# EAGLE design Programmer_ISO (EAGLE 5.04)
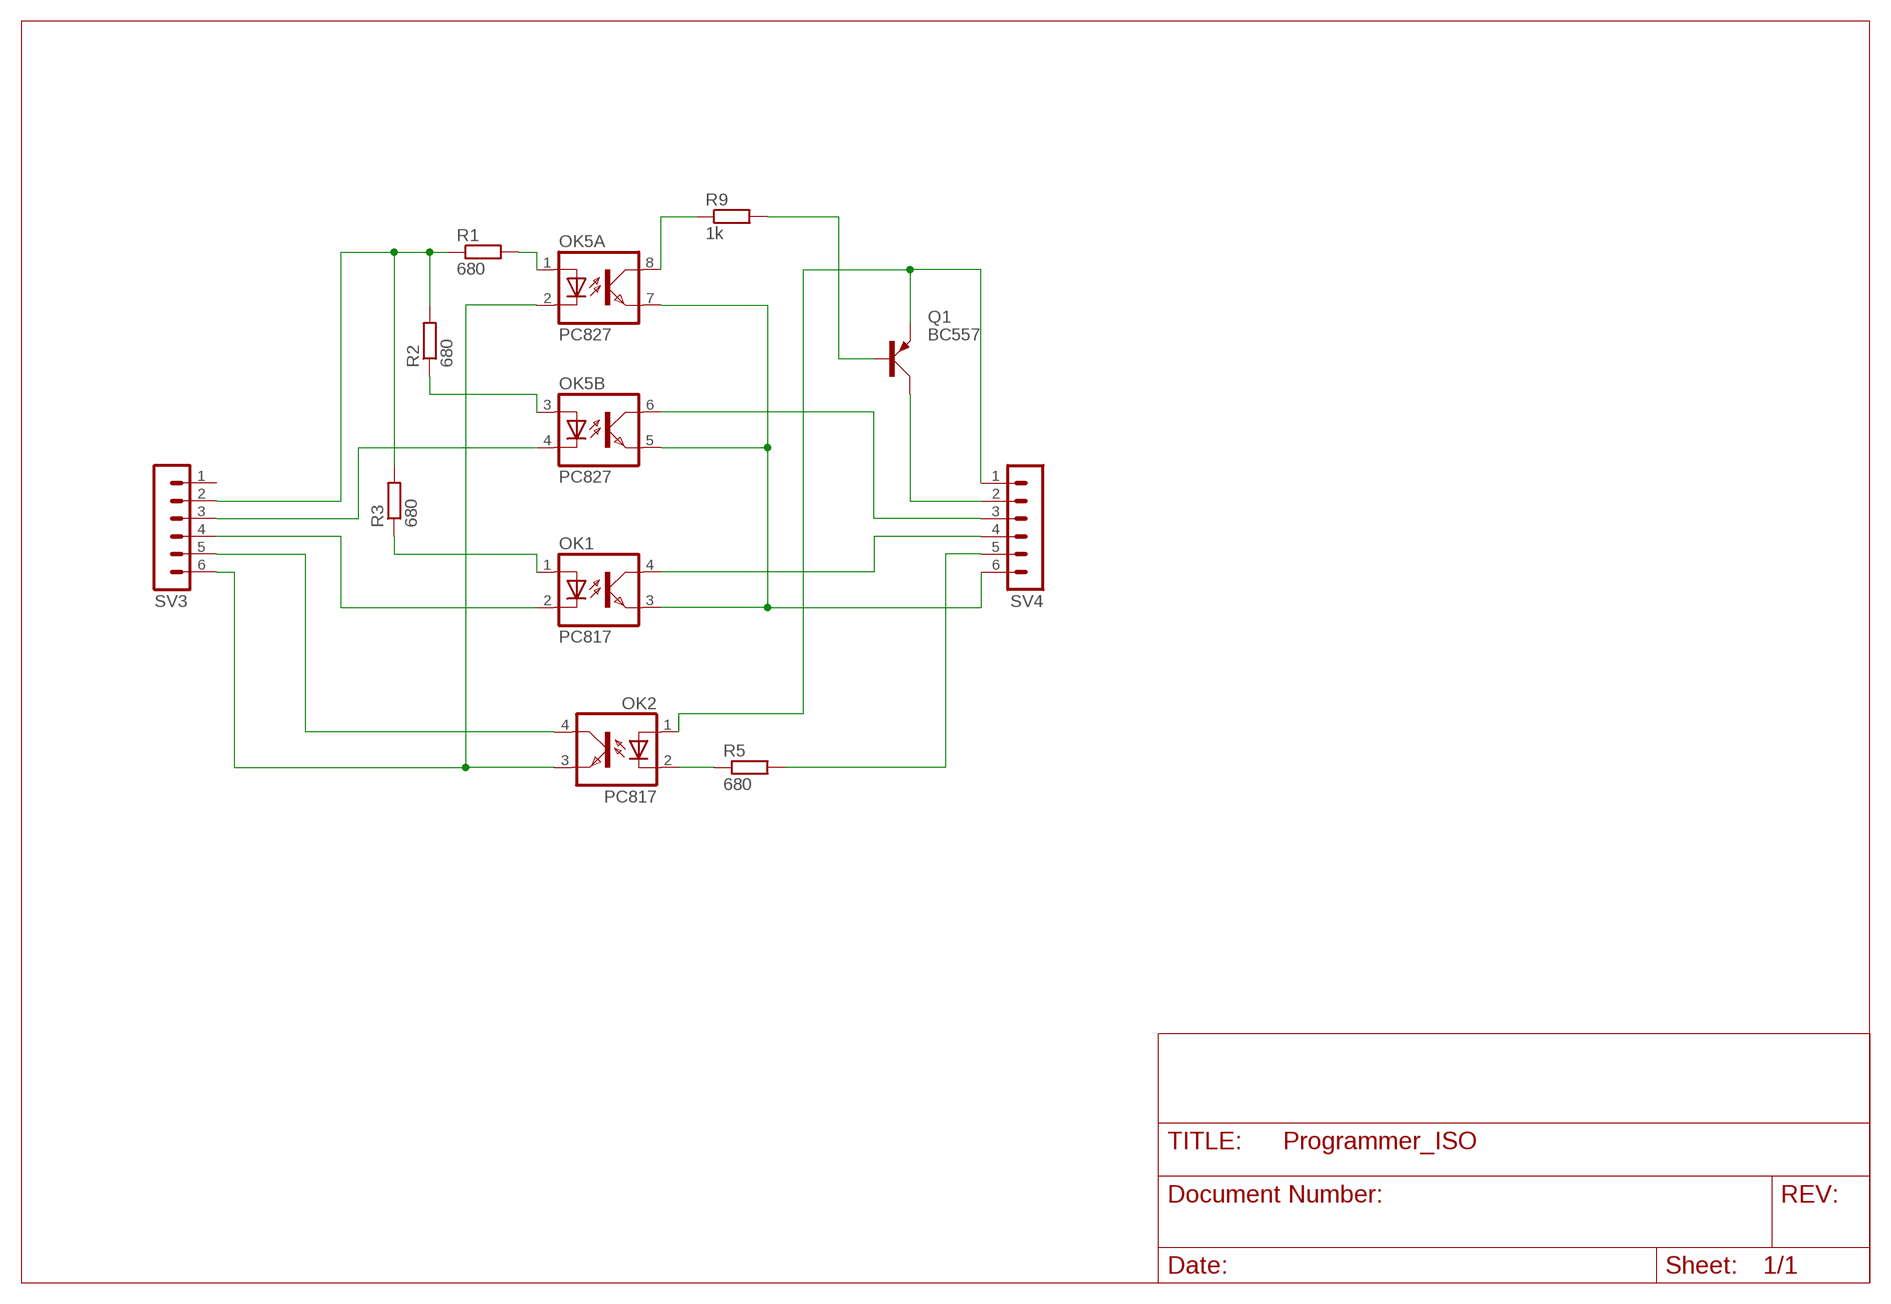
[diagram p0: schematic, sheet 1]

## Parts
OK1  PC817  [DIL04]
OK2  PC817  [DIL04]
OK5  PC827  [DIL08]
Q1  BC557  [SOT54A]
R1  680  R-EU_0207/7  [0207/7]
R2  680  R-EU_0207/7  [0207/7]
R3  680  R-EU_0207/7  [0207/7]
R5  680  R-EU_0207/7  [0207/7]
R9  1k  R-EU_0207/7  [0207/7]
SV3  MA06-1  [MA06-1]
SV4  MA06-1  [MA06-1]

## Nets
GND_PROG: OK2.3(EMIT) OK5.2(A:C) SV3.6
GND_TARGET: OK1.3(EMIT) OK5.5(B:EMIT) OK5.7(A:EMIT) SV4.6
N$1: OK5.8(A:COL) R9.1
N$2: Q1.B R9.2
N$3: OK1.1(A) R3.1
N$6: OK5.1(A:A) R1.2
N$7: OK5.3(B:A) R2.1
N$13: OK2.2(C) R5.1
RST_PROG: OK5.4(B:C) SV3.3
RST_TARGET: OK5.6(B:COL) SV4.3
RXD_PROG: OK2.4(COL) SV3.5
RXD_TARGET: R5.2 SV4.5
TXD_PROG: OK1.2(C) SV3.4
TXD_TARGET: OK1.4(COL) SV4.4
VCC_PROG: R1.1 R2.2 R3.2 SV3.2
VIN_TARGET: Q1.C SV4.2
VOUT_TARGET: OK2.1(A) Q1.E SV4.1
Unconnected: SV3.1

## Library data of the parts
OK1 OK2 = optocoupler:PC817: SHARP OPTO COUPLER
OK5 = optocoupler:PC827: SHARP OPTO COUPLER
Q1 = transistor-small-signal:BC557: PNP TRANSISTOR
R1-R3 R5 R9 = rcl:R-EU_: RESISTOR, European symbol
SV3 SV4 = con-lstb:MA06-1: PIN HEADER

## Board
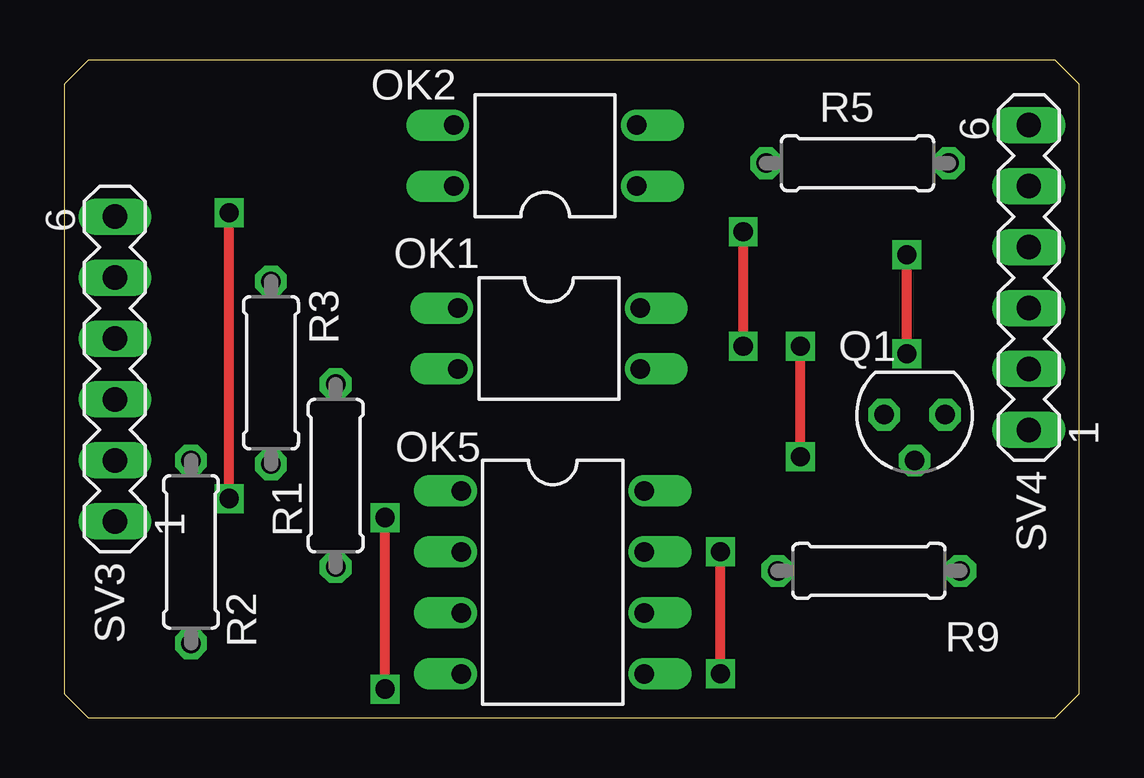
[diagram p1: board, top side]
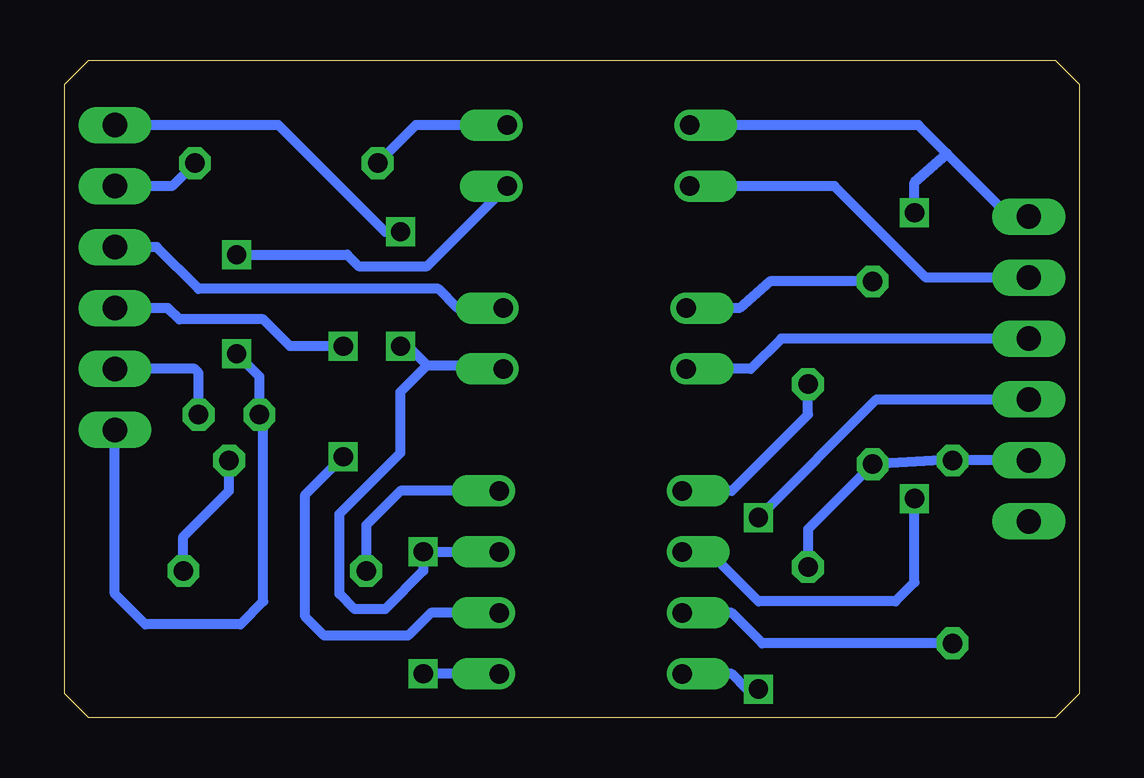
[diagram p2: board, bottom side, seen from below]

Size 42.3 x 27.4 mm. Coordinates in mm from the lower left corner, seen from the top.
Outline: 1,0 41.3,0 42.3,1 42.3,26.4 41.3,27.4 1,27.4 0,26.4 0,1 1,0
Copper layers (1*16): Top 0.035mm / dielectric 1.5mm / Bottom 0.035mm
Design rules "default": minimum track width 10mil, minimum drill 24mil, track to track 8mil, track to pad 8mil, pad to pad 8mil, via to via 8mil, smd to smd 8mil, copper to edge 40mil, drill to drill 8mil, minimum pad ring 10mil, minimum via ring 8mil, stop-mask expansion 4mil, vias tented up to drill 0mil, thermal gap 10mil

### Footprints (pad centres in the part's own frame; a part is rotated, then mirrored left to right if it is on the bottom)
DIL04 = drill 0.813 offset: 1 -1.27,-3.81; 2 1.27,-3.81; 3 1.27,3.81; 4 -1.27,3.81
DIL08 = drill 0.813 offset: 1 -3.81,-3.81; 2 -1.27,-3.81; 3 1.27,-3.81; 4 3.81,-3.81; 5 3.81,3.81; 6 1.27,3.81; 7 -1.27,3.81; 8 -3.81,3.81
SOT54A = drill 0.813 octagon: B 0,1.905; C -1.27,0; E 1.27,0
0207/7 = drill 0.813 octagon: 1 -3.81,0; 2 3.81,0
MA06-1 = drill 1.016 long: 1 -6.35,0; 2 -3.81,0; 3 -1.27,0; 4 1.27,0; 5 3.81,0; 6 6.35,0

### Placement (x,y rotation side)
OK1  20.2,15.8 270 top
OK2  20.04,23.42 90 top
OK5  20.36,5.64 270 top
Q1  35.44,12.62 180 top
R1  11.31,10.08 90 top
R2  5.28,6.91 90 top
R3  8.61,14.37 270 top
R5  33.06,23.1 0 top
R9  33.53,6.11 0 top
SV3  2.1,14.53 90 top
SV4  40.2,18.34 90 top

### Tracks (layer width: path | path; a pad name or v marks a point on that pad's centre or on a via)
GND_PROG  (via drill 0.8)
  Top 0.406: v6.86,9.13 v6.86,21.03
  Bottom 0.406: SV3.6 2.9,20.88 5.51,23.49 | 5.51,23.49 6.71,24.69 OK2.3 | OK5.2 15.44,6.91 13.37,4.84 7.66,4.84 6.86,5.64 v6.86,9.13 | v6.86,21.03 6.86,22.3 5.51,23.49
GND_TARGET  (via drill 0.8)
  Top 0.406: v28.3,15.48 v28.3,20.24 | v27.34,1.83 v27.34,6.91
  Bottom 0.406: 27.18,14.68 24.17,14.68 OK1.3 | SV4.6 33.38,24.69 28.93,20.24 v28.3,20.24 | v28.3,15.48 27.98,15.48 27.18,14.68 | OK5.5 v27.34,1.83 | OK5.7 v27.34,6.91 27.34,6.11 28.93,4.52 30.2,4.52 30.84,5.16 30.84,8.49 28.3,11.03 28.3,13.57 27.18,14.68 | OK1.3
N$1
  Bottom 0.406: OK5.8 28.3,9.45 29.72,8.02 R9.1
N$2
  Bottom 0.406: R9.2 37.34,7.54 35.44,9.45 Q1.B | Q1.B
N$3
  Bottom 0.406: R3.1 12.9,18.18 14.17,17.07 OK1.1
N$6
  Bottom 0.406: R1.2 11.31,12.62 14.48,9.45 OK5.1
N$7
  Bottom 0.406: R2.1 13.21,3.1 14.48,4.37 OK5.3
N$13
  Bottom 0.406: OK2.2 27.66,24.69 R5.1
RST_PROG  (via drill 0.8)
  Top 0.406: v13.37,1.19 v13.37,8.33
  Bottom 0.406: SV3.3 8.45,13.26 v13.37,8.33 | v13.37,1.19 13.85,1.19 14.48,1.83 OK5.4
RST_TARGET  (via drill 0.8)
  Top 0.406: v30.68,10.87 v30.68,15.48
  Bottom 0.406: OK5.6 27.03,4.37 27.98,3.41 31.47,3.41 32.26,4.21 32.26,9.29 v30.68,10.87 | v30.68,15.48 32.9,15.48 34.01,16.59 37.5,16.59 37.98,17.07 SV4.3
RXD_PROG
  Bottom 0.406: SV3.5 6.39,18.34 10.2,22.15 OK2.4
RXD_TARGET
  Bottom 0.406: R5.2 37.82,22.15 SV4.5
TXD_PROG
  Bottom 0.406: SV3.4 12.42,15.8 13.69,14.53 OK1.2
TXD_TARGET
  Bottom 0.406: OK1.4 25.91,17.07 26.71,17.86 36.71,17.86 38.46,19.61 SV4.4
VCC_PROG
  Bottom 0.406: R1.1 11.31,7.86 R3.2 5.75,10.72 R2.2 SV3.2
VIN_TARGET
  Bottom 0.406: Q1.C 36.71,14.37 36.87,14.53 SV4.2
VOUT_TARGET  (via drill 0.8)
  Top 0.406: v35.12,15.16 v35.12,19.29
  Bottom 0.406: OK2.1 | OK2.1 27.18,18.81 30.04,18.81 30.52,19.29 v35.12,19.29 | SV4.1 40.2,5.16 38.93,3.89 34.96,3.89 34.01,4.84 34.01,12.46 Q1.E 34.17,14.21 v35.12,15.16